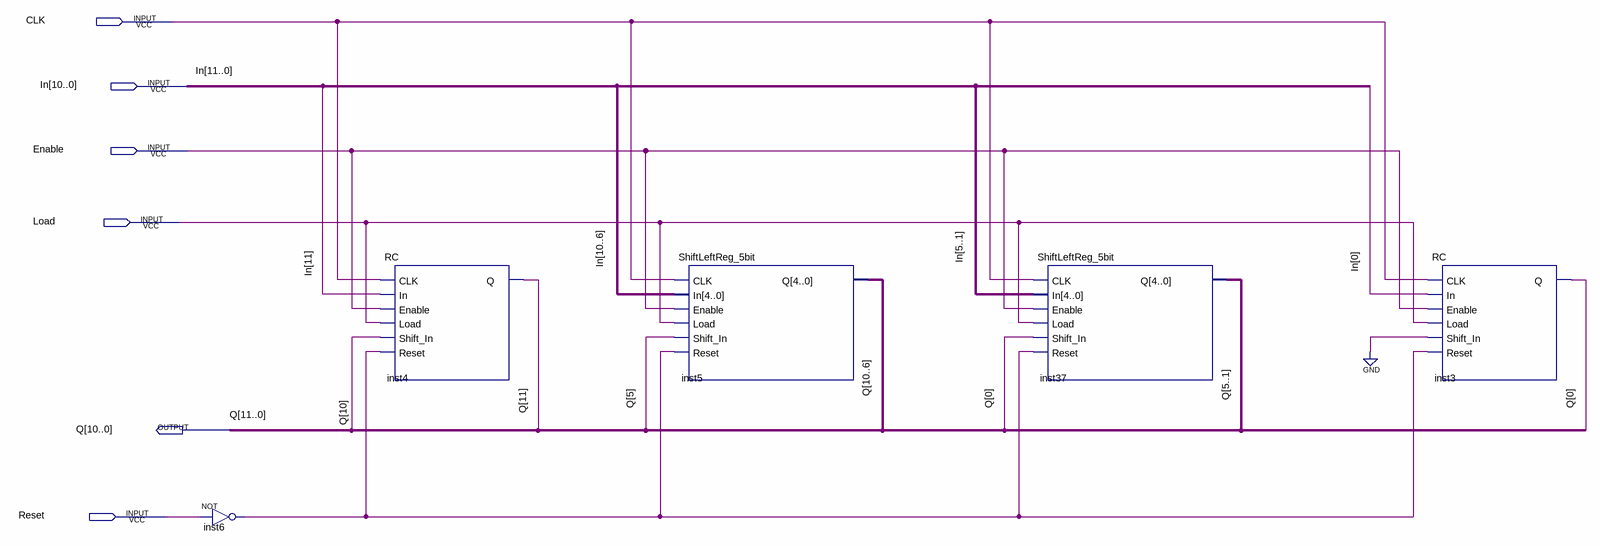
[diagram p0: schematic sheet]
// Quartus schematic ShiftLeftReg_12bit.bdf as structural Verilog: 5 symbols, 6 pins
module ShiftLeftReg_12bit (
  input  CLK,
  input  [11:0] In,
  input  Enable,
  input  Load,
  input  Reset,
  output [11:0] Q
);

  wire inst6_out;

  not inst6 (inst6_out, Reset);
  RC inst4 (.CLK(CLK), .In(In[11]), .Enable(Enable), .Load(Load), .Shift_In(Q[10]), .Reset(inst6_out), .Q(Q[11]));
  ShiftLeftReg_5bit inst5 (
    .CLK(CLK), .In(In[10:6]), .Enable(Enable), .Load(Load), .Shift_In(Q[5]), .Reset(inst6_out), .Q(Q[10:6]));
  ShiftLeftReg_5bit inst37 (
    .CLK(CLK), .In(In[5:1]), .Enable(Enable), .Load(Load), .Shift_In(Q[0]), .Reset(inst6_out), .Q(Q[5:1]));
  RC inst3 (.CLK(CLK), .In(In[0]), .Enable(Enable), .Load(Load), .Shift_In(1'b0), .Reset(inst6_out), .Q(Q[0]));
endmodule
